# EAGLE design FAJAS_EDCPSU_USBC_single (EAGLE 9.6.2)
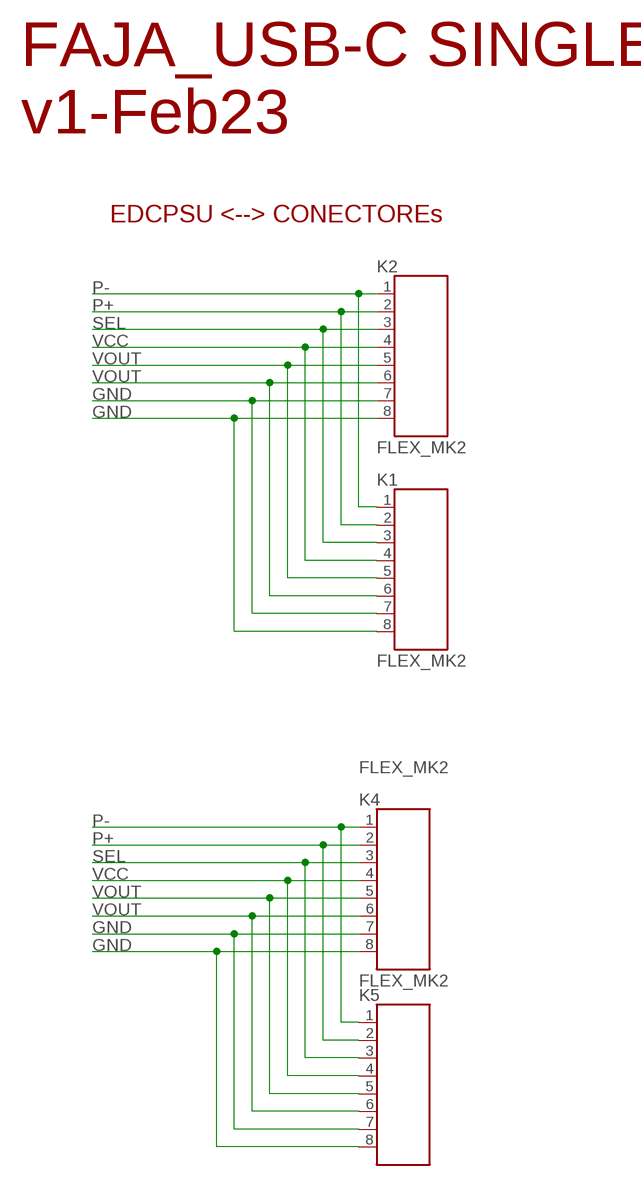
[diagram p0: schematic, sheet 1]

## Parts
K1  FLEX_MK2  FLEX8  [FLEX8]
K2  FLEX_MK2  FLEX8  [FLEX8]
K4  FLEX_MK2  FLEX8  [FLEX8]
K5  FLEX_MK2  FLEX8  [FLEX8]

## Nets
GND: K1.7 K1.8 K2.7 K2.8 K4.7 K4.8 K5.7 K5.8
P+: K1.2 K2.2 K4.2 K5.2
P-: K1.1 K2.1 K4.1 K5.1
SEL: K1.3 K2.3 K4.3 K5.3
VCC: K1.4 K2.4 K4.4 K5.4
VOUT: K1.5 K1.6 K2.5 K2.6 K4.5 K4.6 K5.5 K5.6

## Notes on the sheet
- FAJA_USB-C SINGLE
  v1-Feb23
- EDCPSU <--> CONECTOREs

## Library data of the parts
K1 K2 K4 K5 = Flex_Faja_connector:FLEX8: WR-FPC 1mm SMT Horiz. Bot. Contact Hinge type WR-FPC 1mm 08 pins Hinge type SMT Horizontal Bottom Contact ;=>Code : Con_FPC_ZIF_1.00_6861xx148922_686108148922 <http://katalog.we-online.de/media/images/eican/Con_FPC_ZIF_1.00_686110148922_pf2.jpg> Details see: http://katalog.we-online.de/em/datasheet/6861xx148922.pdf Created 2014-10-08, Karrer Zheng 2014 (C) Wurth Elektronik

## Net classes
1 power: width 0.178 mm
2 gnd: width 0.305 mm, drill 0.483 mm, clearance 0.203 mm

## Board
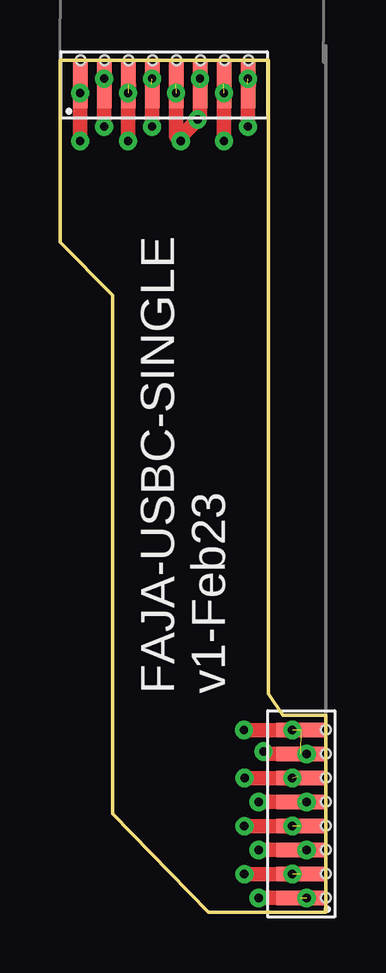
[diagram p1: board, top side]
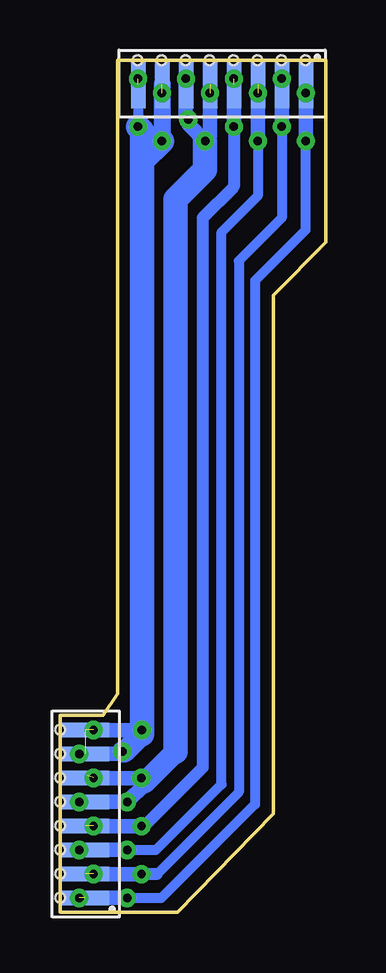
[diagram p2: board, bottom side, seen from below]

Size 11.1 x 35.5 mm. Coordinates in mm from the lower left corner, seen from the top.
Outline: 6.2,0 2.2,4.1 2.2,25.7 0,27.9 0,35.5 8.7,35.5 8.7,9.1 9.3,8.2 11.1,8.2 11.1,0 6.2,0
Copper layers (1*16): Top 0.035mm / dielectric 1.5mm / Bottom 0.035mm
Design rules "default *": minimum track width 6mil, minimum drill 0.25mm, track to track 10mil, track to pad 10mil, pad to pad 10mil, via to via 10mil, smd to smd 0mil, copper to edge 0mil, drill to drill 6mil, minimum pad ring 10mil, minimum via ring 8mil, stop-mask expansion 4mil, vias tented up to drill 50mil, thermal gap 10mil
Holes 0.4 mm at 7.86,35.48 6.86,35.48 5.86,35.48 4.86,35.48 3.86,35.48 2.86,35.48 1.86,35.48 0.86,35.48 11.09,4.59 11.09,5.59 11.09,6.59 11.09,7.59 11.09,0.59 11.09,1.59 11.09,2.59 11.09,3.59

### Footprints (pad centres in the part's own frame; a part is rotated, then mirrored left to right if it is on the bottom)
FLEX8 = smd 0.6 x 2: 1 -3.5,0.25; 2 -2.5,0.25; 3 -1.5,0.25; 4 -0.5,0.25; 5 0.5,0.25; 6 1.5,0.25; 7 2.5,0.25; 8 3.5,0.25

### Placement (x,y rotation side)
K1  4.33,34.74 180 bottom
K2  4.35,34.23 0 top
K4  10.29,4.09 90 top
K5  9.79,4.09 90 bottom

### Tracks (layer width: path | path; a pad name or v marks a point on that pad's centre or on a via)
GND  (via drill 0.35)  (5 unrouted)
  Top 0.254: 7.88,34.45 K2.8
  Top 0.508: 7.85,32.71 v7.84,32.72 | K5.8
  Top 0.61: K5.8 v7.68,7.58 | K5.7 8.59,6.59 v8.49,6.68 | v6.84,32.12 K2.7 | v7.84,32.72 7.84,34.42 7.88,34.45
  Bottom 0.254: v6.84,32.12 v6.83,32.11 6.83,32.4 | 7.86,32.7 v7.84,32.72 7.82,32.74
  Bottom 0.406: K1.8 K2.8 v7.84,32.72
  Bottom 0.61: v7.68,7.58 K5.8 | v10.29,6.59 8.59,6.59 v8.49,6.68
  Bottom 0.7: K1.7 6.83,32.4
  Bottom 0.9: v8.49,6.68 8.39,6.68 7.67,7.41
  Bottom 1.016: 7.67,7.41 7.67,31.3 | v7.84,32.72 7.67,32.55 7.67,31.3 | v6.84,32.12 7.67,31.3
  other vias: 6.84,34.12 7.84,34.72 9.69,7.59
P+  (via drill 0.35)  (2 unrouted)
  Top 0.61: K5.2 10.03,1.58 v7.69,1.58 | K2.2 v1.85,32.73 v1.84,32.72
  Bottom 0.406: v1.84,32.72 1.84,28.92 3.63,27.13 3.63,5 7.05,1.58
  Bottom 0.508: 7.05,1.58 v7.69,1.58
  Bottom 0.61: K5.2 10.03,1.58 v7.69,1.58 | v1.84,32.72 v1.84,34.72
  other vias: 9.69,1.59
P-  (via drill 0.35)  (1 unrouted)
  Top 0.254: K5.1
  Top 0.406: v0.84,32.12 v0.84,34.12
  Top 0.61: v8.29,0.59 K5.1 | K2.1 v0.85,32.13 v0.84,32.12
  Bottom 0.406: v8.29,0.59 6.86,0.59 2.96,4.48 2.96,26.3 0.84,28.42 v0.84,32.12
  Bottom 0.61: v8.29,0.59 K5.1 | K1.1 K2.1 v0.84,32.12
  other vias: 10.29,0.59
SEL  (via drill 0.35)  (2 unrouted)
  Top 0.254: 2.88,34.45 K2.3 | K5.3 | v8.29,2.58 v8.29,2.59
  Top 0.61: v8.29,2.59 K5.3 | v2.84,32.12 2.84,34.42 2.88,34.45
  Bottom 0.406: v8.29,2.59 7.09,2.59 4.36,5.32 4.36,28.33 2.84,29.84 v2.84,32.12
  Bottom 0.61: v8.29,2.59 v10.29,2.59 | K1.3 K2.3 v2.84,32.12
  other vias: 2.84,34.12
VCC  (via drill 0.35)  (2 unrouted)
  Top 0.61: K5.4 10.03,3.58 v7.69,3.58 | K2.4 v3.85,32.73 v3.84,32.72
  Bottom 0.406: 7.59,3.58 v7.69,3.58
  Bottom 0.508: v3.84,32.72 3.84,30.22 5.15,28.92 5.15,6.02 7.59,3.58
  Bottom 0.61: K5.4 10.03,3.58 v7.69,3.58 | K1.4 K2.4 v3.84,32.72
  other vias: 3.84,34.72 9.69,3.59
VOUT  (via drill 0.35)  (4 unrouted)
  Top 0.254: K2.6 5.85,33.06
  Top 0.508: K5.6 10.02,5.57 | K5.5 | v5.74,33.02 5.74,33
  Top 0.61: v5.84,34.72 5.84,33.12 v5.74,33.02 5.05,32.32 v5.05,32.13 v5.04,32.12 4.85,32.32 K2.5 | 10.02,5.57 7.72,5.57 v7.7,5.58 | v8.29,4.59 K5.5
  Bottom 0.254: 9.95,5.68 K5.6 | 4.84,34.35 4.71,34.48 K2.5 K1.5
  Bottom 0.508: 5.86,34.46 K1.6
  Bottom 0.61: 4.84,34.35 4.84,32.32 v5.04,32.12 5.74,32.82 v5.74,33.02 5.86,33.14 5.86,34.46 | K5.6 10.03,5.57 7.71,5.57 v7.7,5.58 7.57,5.58 7.57,5.38 7.57,5.31 v8.29,4.59 v10.29,4.59
  Bottom 0.9: 6.27,6.67 7.57,5.38
  Bottom 1.016: v5.04,32.12 5.04,30.92 6.27,29.7 6.27,6.67
  other vias: 9.69,5.59 4.84,34.12

### Text on the board
tNames: FAJA-USBC-SINGLE / v1-Feb23